# Altium schematic sheet IO.SchDoc
size A; SheetNumber: 2; SheetTotal: 4
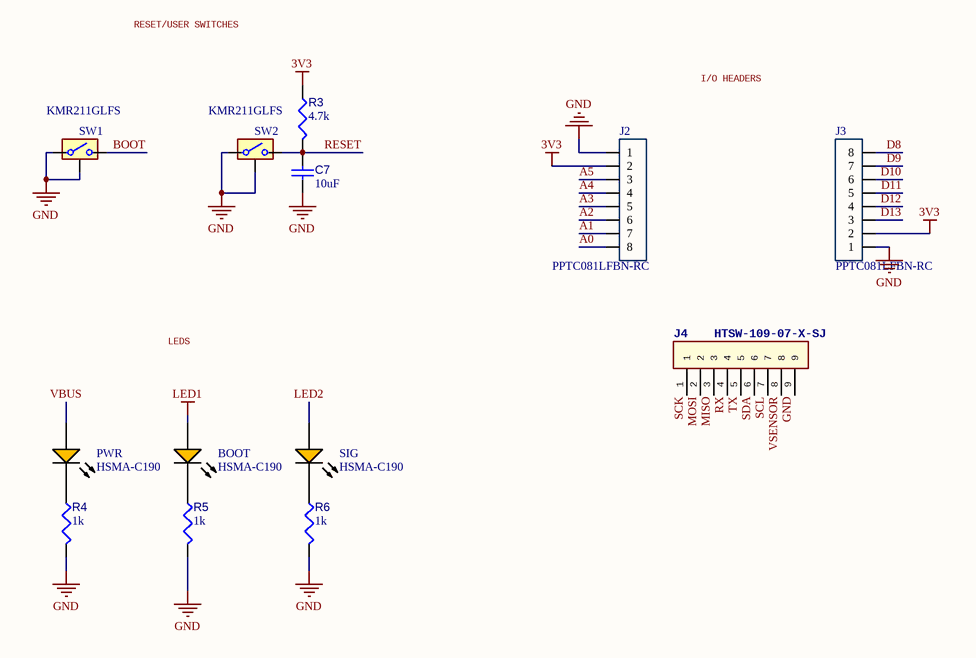
[diagram p0: IO.SchDoc]

## Parts
BOOT  HSMA-C190  [AVAG-HSMX-C190_V]
C7  value 10uF  [CAPC1608X87X35NL15T15]  (hidden comment: Capacitor 10 uF +/- 0.25 uF 50 V 0603)
J2  PPTC081LFBN-RC  [8_PIN_100MIL - Female]
J3  PPTC081LFBN-RC  [8_PIN_100MIL - Female]
J4  HTSW-109-07-X-SJ  [JM-9_HTSW-109-07-X-S]
PWR  HSMA-C190  [AVAG-HSMX-C190_V]
R3  value 4.7k  [RESC1608X55X25ML10T15]  (hidden comment: Resistor 4.7k +/-1% 0603 100 mW)
R4  value 1k  [RESC1608X55X25ML10T15]  (hidden comment: Resistor 1k +/-1% 0603 100 mW)
R5  value 1k  [RESC1608X55X25ML10T15]  (hidden comment: Resistor 1k +/-1% 0603 100 mW)
R6  value 1k  [RESC1608X55X25ML10T15]  (hidden comment: Resistor 1k +/-1% 0603 100 mW)
SIG  HSMA-C190  [AVAG-HSMX-C190_V]
SW1  KMR211GLFS  [FP-KMR211GLFS-MFG]
SW2  KMR211GLFS  [FP-KMR211GLFS-MFG]

## Nets
3V3: J2.2 J3.2 R3.1
GND: C7.1 J2.1 J3.1 J4.9 R4.2 R5.2 R6.2 SW1.1,2 SW1.5 SW2.1,2 SW2.5
LED1: BOOT.1(A)
A0: J2.8
A1: J2.7
A2: J2.6
A3: J2.5
A4: J2.4
A5: J2.3
BOOT: SW1.3,4
D8: J3.8
D9: J3.7
D10: J3.6
D11: J3.5
D12: J3.4
D13: J3.3
LED2: SIG.1(A)
MISO: J4.3
MOSI: J4.2
RESET: C7.2 R3.2 SW2.3,4
RX: J4.4
SCK: J4.1
SCL: J4.7
SDA: J4.6
TX: J4.5
VBUS: PWR.1(A)
VSENSOR: J4.8
NetBOOT_2: BOOT.2(K) R5.1
NetPWR_2: PWR.2(K) R4.1
NetR6_1: R6.1 SIG.2(K)

## Notes on the sheet
- RESET/USER SWITCHES
- I/O HEADERS
- LEDS

## Library data of the parts
BOOT PWR SIG = CMP-007-00011-2: LED Uni-Color Amber, 60 mW, 20 mA, -40 to 85 degC, 2-Pin SMD, RoHS, Tape and Reel; Manufacturer: Avago; Forward Current: 20mA; Luminous Intensity: 90mcd; Lens Style: Diffused; Power: 60mW; Nominal Vf: 1.9V; Viewing Angle: 170degrees; Illumination Colour: Orange; Datasheet Version: Sep-10; Mounting Technology: SM; Case/Package: 0603; RoHS Compliant: True; Pins: 2; Packaging: TapeandReel; Colour: Orange; Package Reference: HSMX-C190; Manufacturer URL: http://www.avagotech.com/; Package Quantity: 4000; Min Operating Temperature: -40°C; Datasheet URL: http://docs.avagotech.com/docs/AV02-0112EN; Max Operating Temperature: 85°C; Forward Voltage: 1.9V; Package Description: 2-Pin Surface Mount Device, Body 1.6 x 0.8 mm, Height 0.9 mm
C7 = CMP-001-00012-6: Chip Capacitor, 10 uF, +/- 0.25 uF, 50 V, 0603 (1608 Metric); Tolerance: 0.25%; Capacitor Type: Ceramic; Voltage Rating: 50V; Max Operating Temperature: 125°C; RoHS Compliant: True; Mounting Technology: SM; Pins: 2; Case/Package: 0603; Min Operating Temperature: -55°C
J2 J3 = JF_8_PIN_FEMALE: 8 Position Header Connector 0.100" (2.54mm) Through Hole Tin; Digikey Link: https://www.digikey.com/product-detail/en/PPTC081LFBN-RC/S7006-ND/810147/?itemSeq=304982354; MFR Part #: PPTC081LFBN-RC; Type: Extended; LCSC Part#: C27438
J4 = JM_9_PIN_MALE: 2.54mm Black 1x9P Straight,P=2.54mm Pin Headers; MFR PART #: PZ254-1-09-Z-8.5; MFR PN: HTSW-109-07-X-SJ; LCSC PART#: C2894932
R3 = CMP-009-00023-5: Chip Resistor, 4.7 KOhm, +/- 1%, 0.1 W, -55 to 155 degC, 0603 (1608 Metric); Voltage Rating: 50V; Power: 100mW; Max Operating Temperature: 155°C; RoHS Compliant: True; Tolerance: 1%; Pins: 2; Case/Package: 0603; Mounting Technology: SM; Min Operating Temperature: -55°C
R4-R6 = CMP-009-00023-5: Chip Resistor, 1 KOhm, +/- 1%, 0.1 W, -55 to 155 degC, 0603 (1608 Metric); Voltage Rating: 50V; Power: 100mW; Max Operating Temperature: 155°C; RoHS Compliant: True; Tolerance: 1%; Pins: 2; Case/Package: 0603; Mounting Technology: SM; Min Operating Temperature: -55°C
SW1 SW2 = CMP-011-00013-6: Design Item ID: KMR211GLFS; Source: KMR211GLFS.SchLib